# EasyEDA schematic 智能校卡PCB.json
TITLE: 2023/7/20; REV: 1.0; Date: 2023-07-20; Sheet: 1/1; Drawn By: a1392675853a; Company: 物联网（墨水屏）
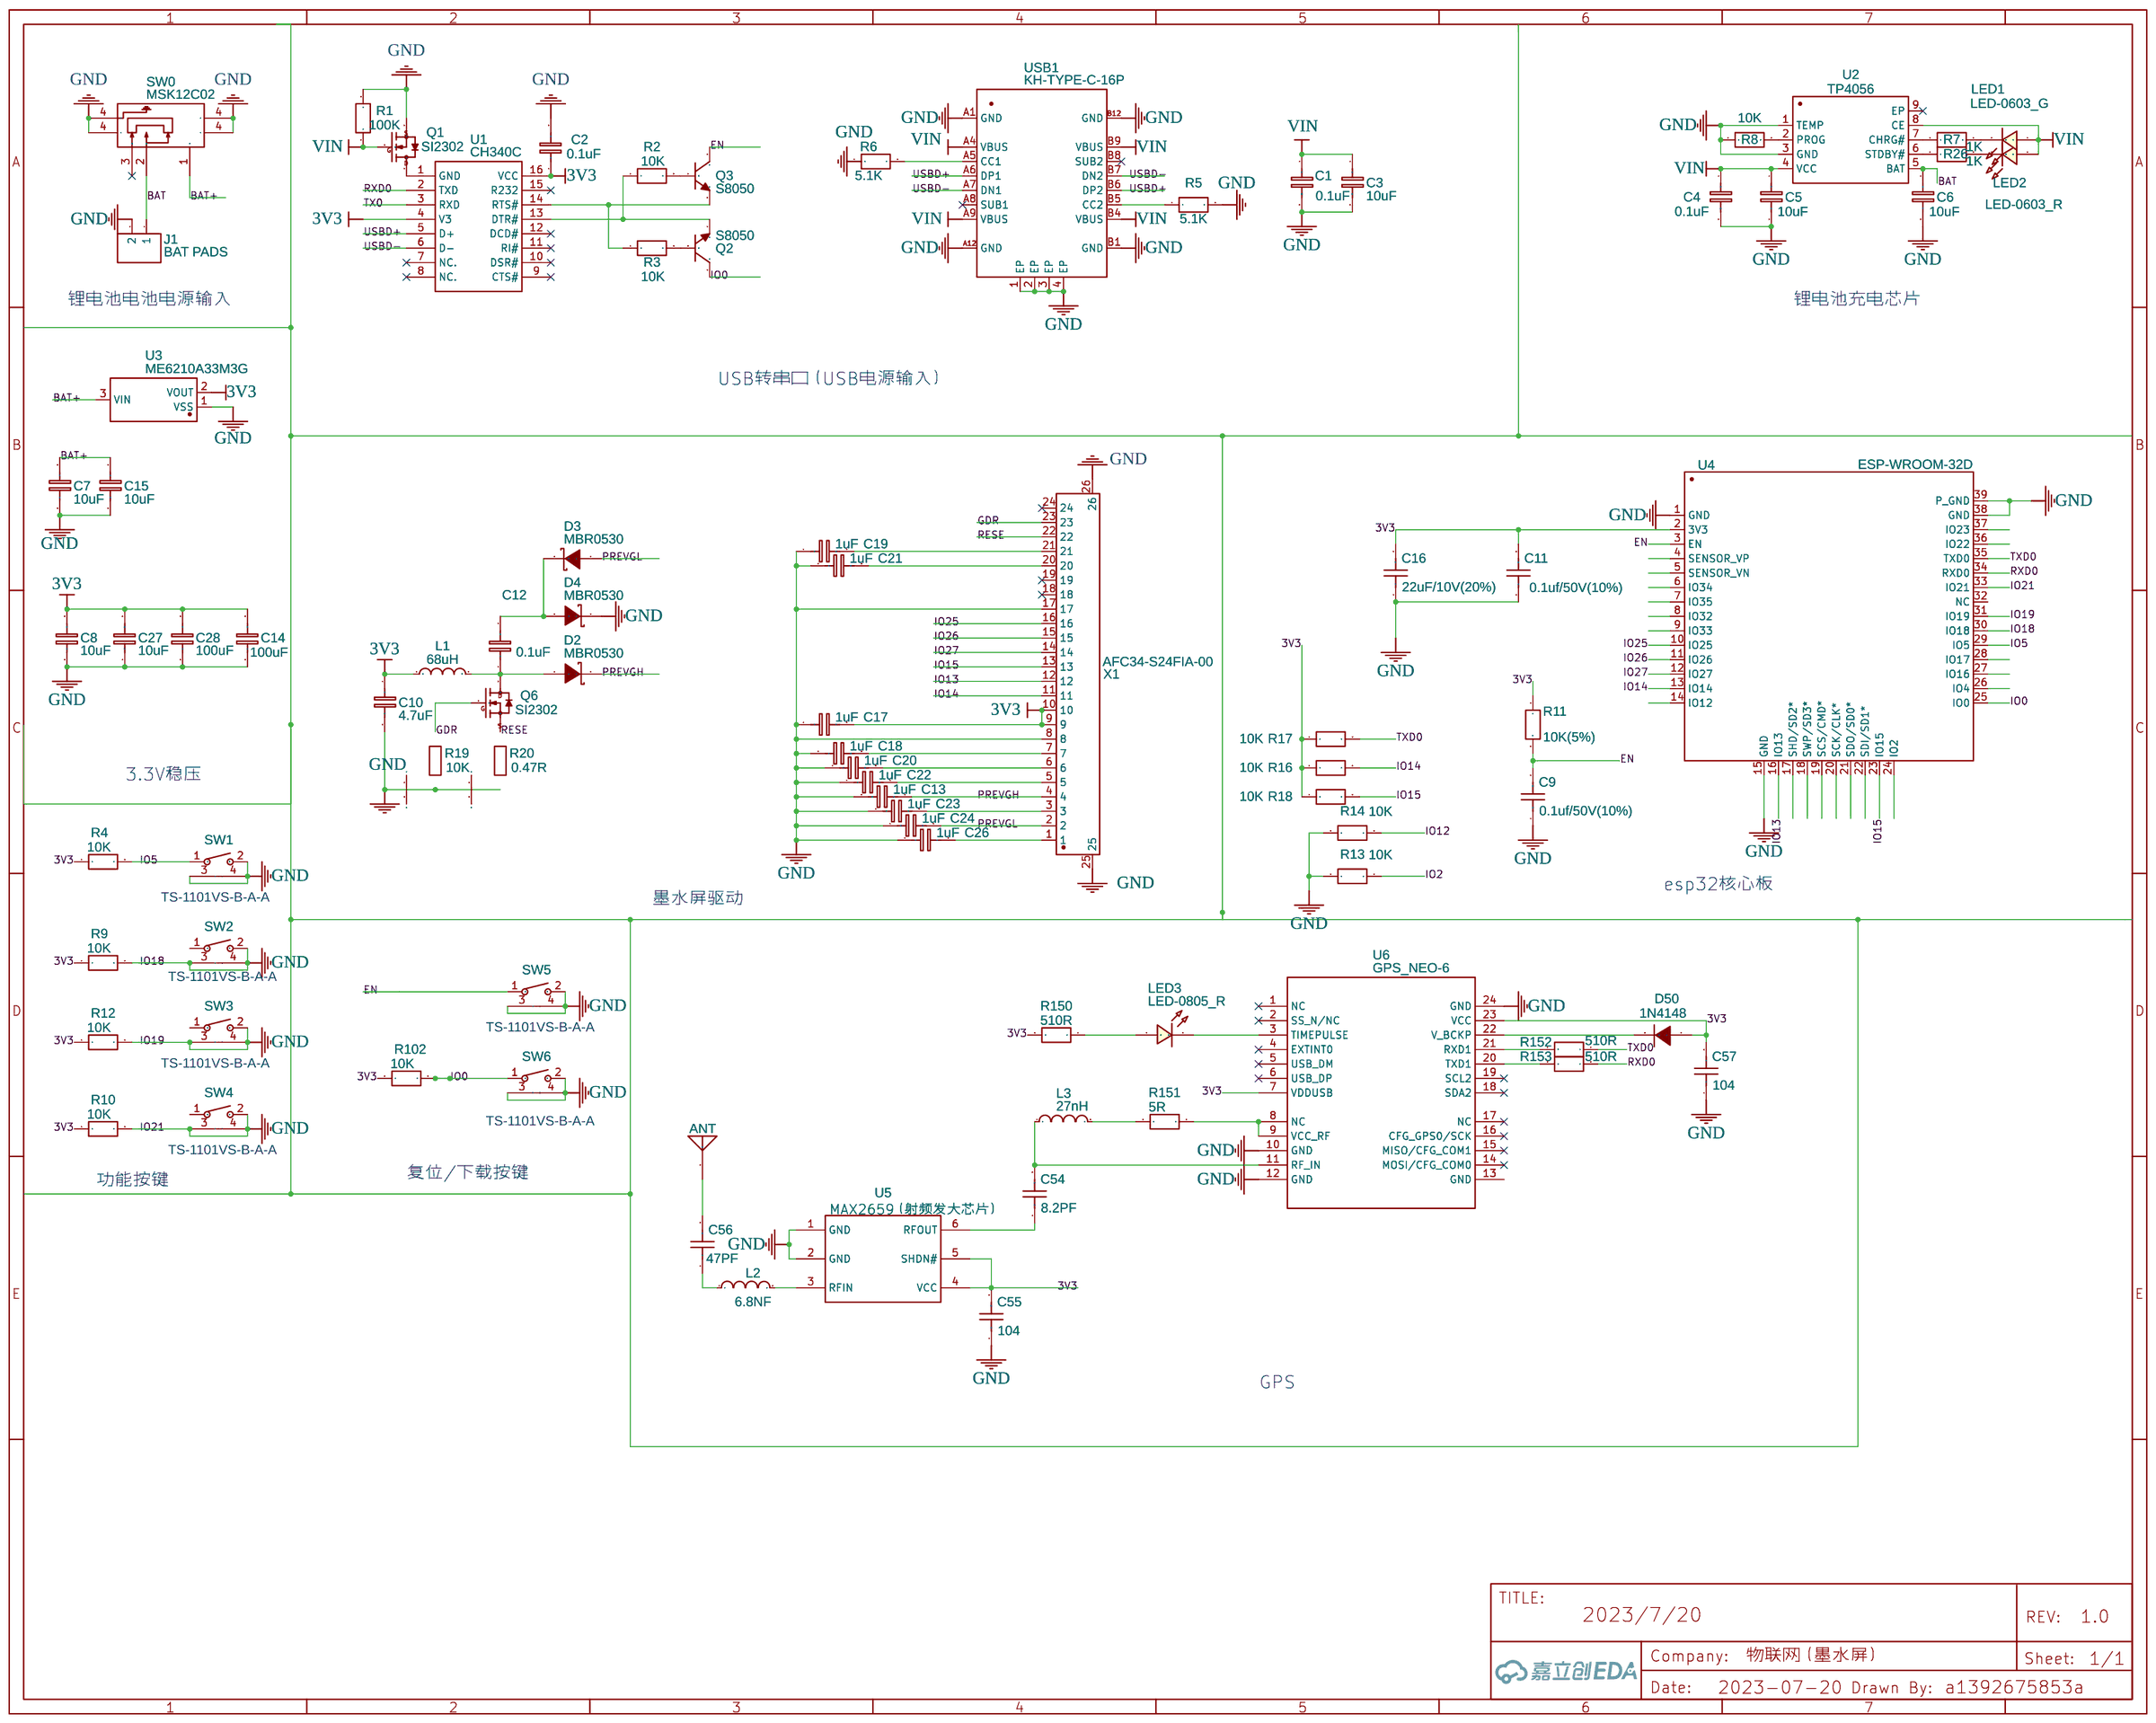
[diagram p0: schematic sheet]

## Parts
ANT1  ANT  [ANT-TH_BW2.4TNDX-Y182]
C1  0.1uF  [C0603]
C2  0.1uF  [C0603]
C3  10uF  [C0603]
C4  0.1uF  [C0603]
C5  10uF  [C0603]
C6  10uF  [C0603]
C7  10uF  [C0603]
C8  10uF  [C0603]
C9  0.1uf/50V(10%)  [C0805]
C10  4.7uF  [C0603]
C11  0.1uf/50V(10%)  [C0805]
C12  0.1uF  [C0603]
C13  1uF  [C0603]
C14  100uF  [C1210]
C15  10uF  [C0603]
C16  22uF/10V(20%)  [C0805]
C17  1uF  [C0603]
C18  1uF  [C0603]
C19  1uF  [C0603]
C20  1uF  [C0603]
C21  1uF  [C0603]
C22  1uF  [C0603]
C23  1uF  [C0603]
C24  1uF  [C0603]
C26  1uF  [C0603]
C27  10uF  [C0603]
C28  100uF  [C1210]
C54  8.2PF  [C0805]
C55  104  [C0805]
C56  47PF  [C0805]
C57  104  [C0805]
D2  MBR0530  [SOD-123]
D3  MBR0530  [SOD-123]
D4  MBR0530  [SOD-123]
D50  1N4148  [SOD-123_L2.8-W1.8-LS3.7-RD]
J1  BAT PADS  [HDR-F-2.54_1X2]
L1  68uH  [IND-SMD_L3.5-W3.0]
L2  6.8NF  [L0603]
L3  27nH  [L0603]
LED1  LED-0603_G  [LED0603_GREEN]
LED2  LED-0603_R  [LED0603_RED]
LED3  LED-0805_R  [LED0805_RED]
Q1  SI2302  [SOT-23(SOT-23-3)]
Q2  S8050  [SOT-23-3_L3.0-W1.7-P0.95-LS2.9-BR]
Q3  S8050  [SOT-23-3_L3.0-W1.7-P0.95-LS2.9-BR]
Q6  SI2302  [SOT-23(SOT-23-3)]
R1  100K  [R0603]
R2  10K  [R0603]
R3  10K  [R0603]
R4  10K  [R0603]
R5  5.1K  [R0603]
R6  5.1K  [R0603]
R7  1K  [R0603]
R8  10K  [R0603]
R9  10K  [R0603]
R10  10K  [R0603]
R11  10K(5%)  [R0805]
R12  10K  [R0603]
R13  10K  [R0603]
R14  10K  [R0603]
R16  10K  [R0603]
R17  10K  [R0603]
R18  10K  [R0603]
R19  10K  [R0603]
R20  0.47R  [R0603]
R26  1K  [R0603]
R102  10K  [R0603]
R150  510R  [R0805]
R151  5R  [R0805]
R152  510R  [R0805]
R153  510R  [R0805]
SW0  MSK12C02  [SW-TH_MSK12C02]
SW1  TS-1101VS-B-A-A  [SW-SMD_TS-1101VS-C-A-B]
SW2  TS-1101VS-B-A-A  [SW-SMD_TS-1101VS-C-A-B]
SW3  TS-1101VS-B-A-A  [SW-SMD_TS-1101VS-C-A-B]
SW4  TS-1101VS-B-A-A  [SW-SMD_TS-1101VS-C-A-B]
SW5  TS-1101VS-B-A-A  [SW-SMD_TS-1101VS-C-A-B]
SW6  TS-1101VS-B-A-A  [SW-SMD_TS-1101VS-C-A-B]
U1  CH340C  [SOP-16_L10.0-W3.9-P1.27-LS6.0-BL]
U2  TP4056  [ESOP-8_L4.9-W3.9-P1.27-LS6.0-BL-EP]
U3  ME6210A33M3G  [SOT-23-3_L3.0-W1.7-P0.95-LS2.9-BR]
U4  ESP-WROOM-32D  [COMM-SMD_ESP-WROOM-32D]
U5  MAX2659（射频发大芯片）  [UDFN-6_L1.5-W1.0-P0.50-BL]
U6  GPS_NEO-6  [GPS_NEO-6]
USB1  KH-TYPE-C-16P  [USB-C-SMD_KH-TYPE-C-16P]
X1  AFC34-S24FIA-00  [FPC-SMD_AFC34-S24FIA-00]

## Library data of the parts
ANT1 = BW2.4TNDX-Y182: Supplier: LCSC; Supplier Part: C5183844; Manufacturer: null; Contributor: lcsc; JLCPCB Part Class: Extended Part
C1-C8 C12 C13 C15 C17-C24 C26 C27 = C_0603_EU: Contributor: LCEDA_Lib
C9 C11 C16 C54-C57 = 22uF ±20% 10V: Supplier: LCSC; Supplier Part: C19704; Manufacturer: SAMSUNG(三星); Contributor: LCSC; JLCPCB Part Class: Extended Part
C10 = Capacitor: Manufacturer Part: CL10A475MP5LNNC; Supplier: LCSC; Manufacturer: Samsung Electro-Mechanics; Supplier Part: C318644
C14 C28 = C_1206_EU: Contributor: LCEDA_Lib
D2-D4 = -: Supplier: LCSC; Supplier Part: C77336
D50 = 1N4148W-E3-08: Supplier: LCSC; Supplier Part: C241939; Manufacturer: VISHAY(威世); Contributor: LCSC; JLCPCB Part Class: Extended Part
J1 = HDR-F-2.54_1x2: Supplier Part: C49661; Supplier: LCSC; Contributor: LCEDA_Lib; Package Display: No
L1 = CD32-680M: Supplier: LCSC; Supplier Part: C2826627; Manufacturer: DMBJ(振宝佳); JLCPCB Part Class: Extended Part; Contributor: LCSC
L2 L3 = SDCL1608C27NJTDF: Supplier: LCSC; Manufacturer: Sunlord; Supplier Part: C12100; JLCPCB Part Class: Extended Part; Contributor: Cwen
LED1 = LED-0603_G: Manufacturer: EVERLIGHT(台湾亿光); Manufacturer Part: 19-217/GHC-YR1S2/3T; Supplier Part: C72043; Supplier: LCSC; Contributor: LCEDA_Lib
LED2 = LED-0603_R: Manufacturer: EVERLIGHT(台湾亿光); Manufacturer Part: 19-217/R6C-AL1M2VY/3T; Supplier Part: C72044; Supplier: LCSC; Contributor: LCEDA_01
LED3 = LED-0805_R: Manufacturer: EVERLIGHT(台湾亿光); Manufacturer Part: 17-21SURC/S530-A3/TR8; Supplier Part: C72037; Contributor: LCEDA_Lib
Q1 Q6 = -: Supplier: LCSC; Manufacturer: Hottech; Contributor: LCSC; Supplier Part: C181087; LCSC Assembly: Yes; SMT Type: Extend
Q2 Q3 = S8050_C2146: Supplier: LCSC; Manufacturer: CJ(江苏长电/长晶); Manufacturer Part: S8050 J3Y; Supplier Part: C2146; JLCPCB Part Class: Basic Part
R1-R10 R12-R14 R16-R18 R26 R102 = R_0603_EU: Contributor: LCEDA_Lib
R11 R150-R153 = R_0805_EU: Contributor: LCEDA_Lib
R19 = Resistor: Manufacturer Part: CRCW060310K0JNEA; Supplier: LCSC; Manufacturer: Vishay Intertech; Supplier Part: C169103
R20 = Resistor: Manufacturer Part: CR0603F0R47P05; Supplier: LCSC; Manufacturer: Ever Ohms Tech; Supplier Part: C175657
SW0 = MSK12C02: Supplier: LCSC; Supplier Part: C431540; Manufacturer: SHOU HAN; Contributor: LCSC; JLCPCB Part Class: Extended Part
SW1-SW6 = TS-1101VS-B-A-A: Supplier: LCSC; Supplier Part: C561499; Manufacturer: XKB Enterprise; Contributor: LCSC; JLCPCB Part Class: Extended Part
U1 = CH340C: Supplier: LCSC; Manufacturer: WCH(南京沁恒); Supplier Part: C84681; JLCPCB Part Class: Extended Part
U2 = TP4056_C725790: Supplier: LCSC; Supplier Part: C725790; Manufacturer: UMW(友台半导体); Contributor: LCSC; JLCPCB Part Class: Extended Part
U3 = ME6210A33M3G: Supplier: LCSC; Supplier Part: C236680; Manufacturer: MICRONE(南京微盟); Contributor: LCSC; JLCPCB Part Class: Extended Part
U4 = ESP-WROOM-32D: Supplier: LCSC; Supplier Part: C2894836; JLCPCB Part Class: Extended Part; Contributor: LCSC; Manufacturer: null
U5 = MAX2659ELT+T: Supplier: LCSC; Manufacturer: MAXIM(美信); Supplier Part: C28043; JLCPCB Part Class: Extended Part
U6 = GPS_NEO-6: Contributor: dyf666
USB1 = KH-TYPE-C-16P: Supplier: LCSC; Supplier Part: C709357; Manufacturer: kinghelm(金航标); Contributor: LCSC; JLCPCB Part Class: Extended Part
X1 = AFC34-S24FIA-00: Supplier: LCSC; Supplier Part: C2842527; Manufacturer: JS(钜硕电子); Contributor: LCSC; JLCPCB Part Class: Extended Part

## Nets
3V3: C2.1 C8.2 C10.1 C11.2 C14.2 C16.2 C17.2 C27.2 C28.2 C55.2 C57.2 D50.2(A) L1.1 R4.1 R9.1 R10.1 R11.1 R12.1 R16.1 R17.1 R18.1 R102.1 R150.2 U1.4(V3) U1.16(VCC) U3.2(VOUT) U4.2(3V3) U5.4(VCC) U5.5(SHDN#) U6.7(VDDUSB) U6.23(VCC) X1.9 X1.10
GND: C1.2 C2.2 C3.2 C4.2 C5.2 C6.2 C7.2 C8.1 C9.1 C10.2 C11.1 C13.1 C14.1 C15.2 C16.1 C17.1 C18.1 C19.1 C20.1 C21.1 C22.1 C23.1 C24.1 C26.1 C27.1 C28.1 C55.1 C57.1 D4.2(K) J1.2 Q1.2(S) R1.2 R5.2 R6.1 R8.1 R9.2 R10.2 R12.2 R13.1 R14.1 R19.1 R20.1 SW0.4 SW1.2 SW1.3 SW1.4 SW2.2 SW2.3 SW2.4 SW3.2 SW3.3 SW3.4 SW4.2 SW4.3 SW4.4 SW5.2 SW5.3 SW5.4 SW6.2 SW6.3 SW6.4 U2.1(TEMP) U2.3(GND) U3.1(VSS) U4.1(GND) U4.15(GND) U4.30(IO18) U4.31(IO19) U4.33(IO21) U4.38(GND) U4.39(P_GND) U5.1(GND) U5.2(GND) U6.10(GND) U6.12(GND) U6.24(GND) USB1.1(EP) USB1.2(EP) USB1.3(EP) USB1.4(EP) USB1.A1(GND) USB1.A12(GND) USB1.B1(GND) USB1.B12(GND) X1.8 X1.17 X1.25 X1.26
VIN: C1.1 C3.1 C4.1 C5.1 LED1.1 LED2.1 Q1.1(G) R1.1 U2.4(VCC) U2.8(CE) USB1.A4(VBUS) USB1.A9(VBUS) USB1.B4(VBUS) USB1.B9(VBUS)
BAT: C6.1 J1.1 SW0.2 U2.5(BAT)
BAT+: C7.1 C15.1 SW0.1 U3.3(VIN)
EN: C9.2 Q3.3(C) R11.2 SW5.1 U4.3(EN)
GDR: Q6.1(G) R19.2 X1.23
IO0: Q2.3(C) R102.2 SW6.1 U4.25(IO0)
IO2: R13.2
IO5: R4.2 SW1.1 U4.29(IO5)
IO12: R14.2
IO13: U4.16(IO13) X1.12
IO14: R16.2 U4.13(IO14) X1.11
IO15: R18.2 U4.23(IO15) X1.13
IO25: U4.10(IO25) X1.16
IO26: U4.11(IO26) X1.15
IO27: U4.12(IO27) X1.14
PREVGH: C13.2 D2.2(K) X1.4
PREVGL: C24.2 D3.1(A) X1.2
RESE: Q6.2(S) R20.2 X1.22
RXD0: R153.1 U1.2(TXD) U4.34(RXD0)
TX0: U1.3(RXD)
TXD0: R17.2 R152.1 U4.35(TXD0)
USBD+: U1.5(D+) USB1.A6(DP1) USB1.B6(DP2)
USBD-: U1.6(D-) USB1.A7(DN1) USB1.B7(DN2)
Net-(ANT1-1): ANT1.1 C56.2
Net-(C12-1): C12.1 D2.1(A) L1.2 Q6.3(D)
Net-(C12-2): C12.2 D3.2(K) D4.1(A)
Net-(C18-2): C18.2 X1.7
Net-(C19-2): C19.2 X1.21
Net-(C20-2): C20.2 X1.6
Net-(C21-2): C21.2 X1.20
Net-(C22-2): C22.2 X1.5
Net-(C23-2): C23.2 X1.3
Net-(C26-2): C26.2 X1.1
Net-(C54-1): C54.1 U5.6(RFOUT)
Net-(C54-2): C54.2 L3.1 U6.11(RF_IN)
Net-(C56-1): C56.1 L2.1
Net-(D50-1): D50.1(K) U6.22(V_BCKP)
Net-(L2-2): L2.2 U5.3(RFIN)
Net-(L3-2): L3.2 R151.2
Net-(LED1-2): LED1.2 R7.2
Net-(LED2-2): LED2.2 R26.2
Net-(LED3-1): LED3.1 R150.1
Net-(LED3-2): LED3.2 U6.3(TIMEPULSE)
Net-(Q1-3): Q1.3(D) U1.1(GND)
Net-(Q2-1): Q2.1(B) R3.2
Net-(Q2-2): Q2.2(E) R2.1 U1.13(DTR#)
Net-(Q3-1): Q3.1(B) R2.2
Net-(Q3-2): Q3.2(E) R3.1 U1.14(RTS#)
Net-(R5-1): R5.1 USB1.B5(CC2)
Net-(R6-2): R6.2 USB1.A5(CC1)
Net-(R7-1): R7.1 U2.7(CHRG#)
Net-(R8-2): R8.2 U2.2(PROG)
Net-(R26-1): R26.1 U2.6(STDBY#)
Net-(R151-1): R151.1 U6.8(NC) U6.9(VCC_RF)
Net-(R152-2): R152.2 U6.21(RXD1)
Net-(R153-2): R153.2 U6.20(TXD1)

Not connected (* = marked no-connect by the designer): SW0 3*; SW2 1; SW3 1; SW4 1; U1 7(NC.)* 8(NC.)* 9(CTS#)* 10(DSR#)* 11(RI#)* 12(DCD#)* 15(R232)*; U2 9(EP)*; U4 4(SENSOR_VP) 5(SENSOR_VN) 6(IO34) 7(IO35) 8(IO32) 9(IO33) 14(IO12) 17(SHD/SD2*) 18(SWP/SD3*) 19(SCS/CMD*) 20(SCK/CLK*) 21(SDO/SD0*) 22(SDI/SD1*) 24(IO2) 26(IO4) 27(IO16) 28(IO17) 32(NC) 36(IO22) 37(IO23); U6 1(NC)* 2(SS_N/NC)* 4(EXTINT0)* 5(USB_DM)* 6(USB_DP)* 13(GND) 14(MOSI/CFG_COM0)* 15(MISO/CFG_COM1)* 16(CFG_GPS0/SCK)* 17(NC)* 18(SDA2)* 19(SCL2)*; USB1 A8(SUB1)* B8(SUB2)*; X1 18* 19* 24*

## Notes on the sheet
- 锂电池电池电源输入
- 锂电池充电芯片
- USB转串口（USB电源输入）
- 3.3V稳压
- esp32核心板
- TS-1101VS-B-A-A
- 墨水屏驱动
- TS-1101VS-B-A-A
- TS-1101VS-B-A-A
- TS-1101VS-B-A-A
- TS-1101VS-B-A-A
- TS-1101VS-B-A-A
- 功能按键
- 复位/下载按键
- GPS
